# EAGLE design main (EAGLE 8.3.2)
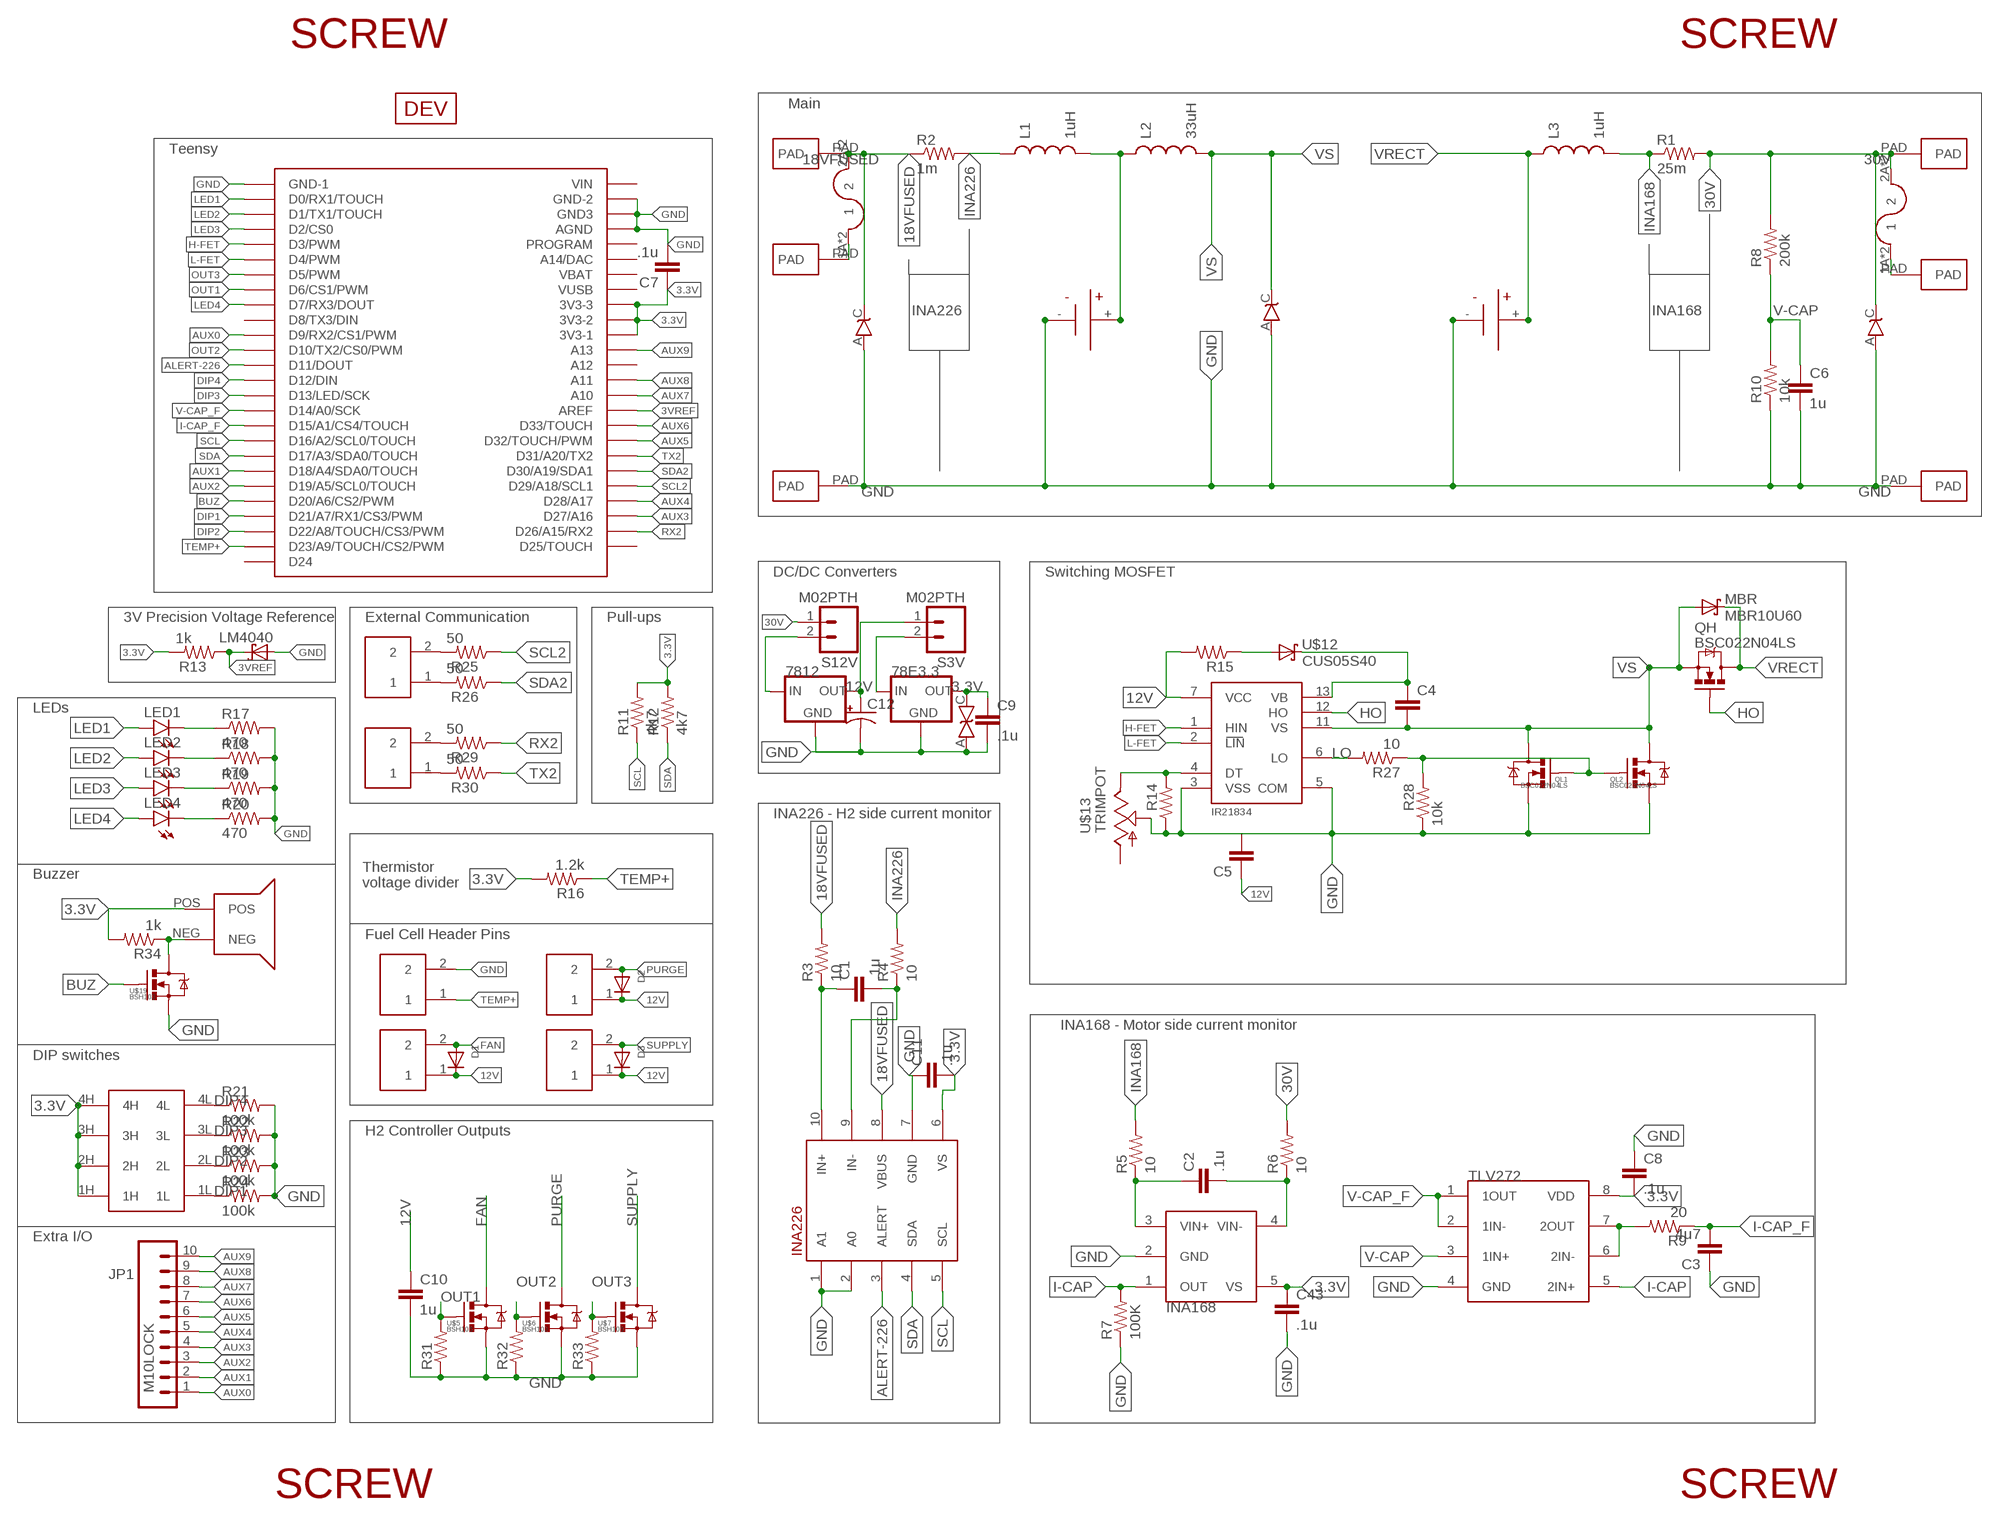
[diagram p0: schematic, sheet 1]

## Parts
78E3.3  V_REG_78XXR-78E  [V78W]
7812  V_REG_78XX  [V78W_BACKWARDS]
C1  .1u  CAP0603-CAP  [0603-CAP]
C1-1  2400u  CAP-AL_ELECTROLYTIC  [CAP-RADIAL]
C2  .1u  CAP0603-CAP  [0603-CAP]
C2-1  2400u  CAP-AL_ELECTROLYTIC  [CAP-RADIAL]
C3  4u7  CAP0603-CAP  [0603-CAP]
C4  CAP0603-CAP  [0603-CAP]
C5  CAP0603-CAP  [0603-CAP]
C6  1u  CAP0603-CAP  [0603-CAP]
C7  .1u  CAP0603-CAP  [0603-CAP]
C8  .1u  CAP0603-CAP  [0603-CAP]
C9  .1u  CAP0603-CAP  [0603-CAP]
C10  1u  CAP0603-CAP  [0603-CAP]
C11  .1u  CAP0603-CAP  [0603-CAP]
C12  10UF-25V-20%(PTH)  [CPOL-RADIAL-10UF-25V]
C43  .1u  CAP0603-CAP  [0603-CAP]
D1  DIODESOT23_REFLOW  [SOT23-R]
D2  DIODESOT23_REFLOW  [SOT23-R]
D3  DIODESOT23_REFLOW  [SOT23-R]
FAN  HEADER2  [2PINVALULOK]
I2C  HEADER2  [2PINVALULOK]
INFUSE  FUSE  [AUTO_FUSE]
JP1  M10LOCK  [1X10_LOCK]
L1  1uH  INDUCTORSER2010-102  [SER20XX]
L2  33uH  D1787-AL  [D1787]
L3  1uH  INDUCTORSER2010-102  [SER20XX]
LED1  LED0603  [LED-0603]
LED2  LED0603  [LED-0603]
LED3  LED0603  [LED-0603]
LED4  LED0603  [LED-0603]
MBR  MBR10U60  [TO-277]
OUTFUSE  FUSE  [AUTO_FUSE]
PURGEVALVE  HEADER2  [2PINVALULOK]
QH  BSC022N04LS  [PG-TDSON-8]
QL1  BSC022N04LS  [PG-TDSON-8]
QL2  BSC022N04LS  [PG-TDSON-8]
R1  25m  RESISTOR2512  [R2512]
R2  1m  RESISTOR2512  [R2512]
R3  10  RESISTOR0603-RES  [0603-RES]
R4  10  RESISTOR0603-RES  [0603-RES]
R5  10  RESISTOR0603-RES  [0603-RES]
R6  10  RESISTOR0603-RES  [0603-RES]
R7  100K  RESISTOR0603-RES  [0603-RES]
R8  200k  RESISTOR0603-RES  [0603-RES]
R9  20  RESISTOR0603-RES  [0603-RES]
R10  10k  RESISTOR0603-RES  [0603-RES]
R11  4k7  RESISTOR0603-RES  [0603-RES]
R12  4k7  RESISTOR0603-RES  [0603-RES]
R13  1k  RESISTOR0603-RES  [0603-RES]
R14  RESISTOR0603-RES  [0603-RES]
R15  RESISTOR0603-RES  [0603-RES]
R16  1.2k  RESISTOR0603-RES  [0603-RES]
R17  470  RESISTOR0603-RES  [0603-RES]
R18  470  RESISTOR0603-RES  [0603-RES]
R19  470  RESISTOR0603-RES  [0603-RES]
R20  470  RESISTOR0603-RES  [0603-RES]
R21  100k  RESISTOR0603-RES  [0603-RES]
R22  100k  RESISTOR0603-RES  [0603-RES]
R23  100k  RESISTOR0603-RES  [0603-RES]
R24  100k  RESISTOR0603-RES  [0603-RES]
R25  50  RESISTOR0603-RES  [0603-RES]
R26  50  RESISTOR0603-RES  [0603-RES]
R27  10  RESISTOR0402-RES  [0402-RES]
R28  10k  RESISTOR0603-RES  [0603-RES]
R29  50  RESISTOR0603-RES  [0603-RES]
R30  50  RESISTOR0603-RES  [0603-RES]
R31  RESISTOR0603-RES  [0603-RES]
R32  RESISTOR0603-RES  [0603-RES]
R33  RESISTOR0603-RES  [0603-RES]
R34  1k  RESISTOR0603-RES  [0603-RES]
S3V  M02PTH  [1X02]
S12V  M02PTH  [1X02]
SERIAL2  HEADER2  [2PINVALULOK]
SUPPLYVALVE  HEADER2  [2PINVALULOK]
THERMISTOR  HEADER2  [2PINVALULOK]
TVS1  TVS_UNIDO-214AB  [DO-214AB]
TVS2  TVS_UNIDO-214AB  [DO-214AB]
TVS3  TVS_UNIDO-214AB  [DO-214AB]
TVS4  3.3V  TVS_BISOD-523  [SOD-523]
U1  INA226  [PSOP-10]
U2  INA168INA168  [SOT23-5]
U3  TLV272  [8-VSSOP]
U$1  PAD  [PAD]
U$2  PAD  [PAD]
U$3  PAD  [PAD]
U$5  BSH103  [SOT23-3]
U$6  BSH103  [SOT23-3]
U$7  BSH103  [SOT23-3]
U$8  SCREW  [M3HOLE]
U$9  IR21834  [SO14]
U$10  PAD  [PAD]
U$11  SCREW  [M3HOLE]
U$12  CUS05S40  [SOD323_ST]
U$13  TRIMPOT  [3MM_TRIMM]
U$14  LM4040  [SOT23-3]
U$16  PAD  [PAD]
U$17  SCREW  [M3HOLE]
U$18  BUZZER12MM  [BUZZER_12MM]
U$19  BSH103  [SOT23-3]
U$20  DIP_SWITCH  [DIPSWITCH4]
U$21  DEV  [DEV]
U$24  PAD  [PAD]
U$26  TEENSY30-FULL  [TEENSY30-FULL]
U$29  SCREW  [M3HOLE]

## Nets
3.3V: 78E3.3.OUT C7.1 C8.2 C9.1 C11.2 C43.1 R11.2 R12.2 R13.2 R16.2 R34.2 TVS4.C U1.6(VS) U2.5(VS) U3.8(VDD) U$18.POS U$20.1H U$20.2H U$20.3H U$20.4H U$26.3V3(3V3-1) U$26.3V3-1(3V3-2) U$26.3V3-2(3V3-3)
3VREF: R13.1 U$14.1(C) U$26.AREF
12V: 7812.OUT C5.1 C10.1 C12.1(+) D1.3(C) D2.3(C) D3.3(C) FAN.1 PURGEVALVE.1 R15.2 S3V.1 SUPPLYVALVE.1 U$9.7(VCC)
18V: INFUSE.1A INFUSE.1B U$24.PAD
18VFUSED: INFUSE.2A INFUSE.2B R2.1 R3.2 TVS1.C U1.8(VBUS) U$3.PAD
30V: OUTFUSE.2A OUTFUSE.2B R1.2 R6.2 R8.2 S12V.1 TVS3.C U$1.PAD
30VFUSED: OUTFUSE.1A OUTFUSE.1B U$16.PAD
ALERT-226: U1.3(ALERT) U$26.D11/DOUT
AUX0: JP1.1 U$26.D9/RX2/CS1/PWM
AUX1: JP1.2 U$26.D18/A4/SDA/TOUCH(D18/A4/SDA0/TOUCH)
AUX2: JP1.3 U$26.D19/A5/SCL/TOUCH(D19/A5/SCL0/TOUCH)
AUX3: JP1.4 U$26.D27(D27/A16)
AUX4: JP1.5 U$26.D28(D28/A17)
AUX5: JP1.6 U$26.D32/TOUCH(D32/TOUCH/PWM)
AUX6: JP1.7 U$26.D33/TOUCH
AUX7: JP1.8 U$26.A10
AUX8: JP1.9 U$26.A11
AUX9: JP1.10 U$26.A13
BUZ: U$19.1(G) U$26.D20/A6/CS2/PWM
DIP1: R24.1 U$20.1L U$26.D21/A7/RX1/CS3/PWM
DIP2: R23.1 U$20.2L U$26.D22/A8/TOUCH/CS3/PWM
DIP3: R22.1 U$20.3L U$26.D13/LED/SCK
DIP4: R21.1 U$20.4L U$26.D12/DIN
DT: R14.2 U$9.4(DT) U$13.3(E)
FAN: D1.1(A) FAN.2 U$5.3(D)
GND: 78E3.3.GND 7812.GND C1-1.-(V-) C2-1.-(V-) C3.1 C5.2 C6.2 C7.2 C8.1 C9.2 C10.2 C11.1 C12.2(-) C43.2 QL1.1(S) QL1.2(S) QL1.3(S) QL2.1(S) QL2.2(S) QL2.3(S) R7.1 R10.1 R14.1 R17.2 R18.2 R19.2 R20.2 R21.2 R22.2 R23.2 R24.2 R28.1 R31.1 R32.1 R33.1 THERMISTOR.2 TVS1.A TVS2.A TVS3.A TVS4.A U1.1(A1) U1.2(A0) U1.7(GND) U2.2(GND) U3.4(GND) U$2.PAD U$5.2(S) U$6.2(S) U$7.2(S) U$9.3(VSS) U$9.5(COM) U$10.PAD U$13.2(S) U$14.2(A) U$19.2(S) U$26.AGND U$26.GND-1 U$26.GND-2 U$26.GND-3(GND3)
H-FET: U$9.1(HIN) U$26.D3/PWM
HO: QH.4(G) U$9.12(HO)
I-CAP: R7.2 U2.1(OUT) U3.5(2IN+)
I-CAP_F: C3.2 R9.1 U$26.D15/A1/CS4/TOUCH
INA168: L3.1 R1.1 R5.2
INA226: L1.2 R2.2 R4.2
L-FET: U$9.2(LIN) U$26.D4/PWM
LED1: LED1.A U$26.D0/RX1/TOUCH
LED2: LED2.A U$26.D1/TX1/TOUCH
LED3: LED3.A U$26.D2/CS0
LED4: LED4.A U$26.D7/RX3/DOUT
LO: QL1.4(G) QL2.4(G) R27.1 R28.2
N$1: C1.1 R3.1 U1.10(IN+)
N$2: C2.1 R5.1 U2.3(VIN+)
N$3: C1.2 R4.1 U1.9(IN-)
N$4: C2.2 R6.1 U2.4(VIN-)
N$5: R15.1 U$12.A
N$6: C1-1.+(V+) L1.1 L2.P$2
N$7: LED1.C R17.1
N$8: LED2.C R18.1
N$9: R9.2 U3.6(2IN-) U3.7(2OUT)
N$10: LED3.C R19.1
N$13: LED4.C R20.1
N$14: I2C.2 R25.2
N$15: I2C.1 R26.2
N$16: R34.1 U$18.NEG U$19.3(D)
N$17: R27.2 U$9.6(LO)
N$18: 78E3.3.IN S3V.2
N$19: 7812.IN S12V.2
N$28: R29.2 SERIAL2.2
N$29: R30.2 SERIAL2.1
OUT1: R31.2 U$5.1(G) U$26.D6/CS1/PWM
OUT2: R32.2 U$6.1(G) U$26.D10/TX2/CS0/PWM
OUT3: R33.2 U$7.1(G) U$26.D5/TX1/PWM(D5/PWM)
PURGE: D2.1(A) PURGEVALVE.2 U$6.3(D)
RX2: R29.1 U$26.D26/RX2(D26/A15/RX2)
SCL: R11.1 U1.5(SCL) U$26.D16/A2/SCL/TOUCH(D16/A2/SCL0/TOUCH)
SCL2: R25.1 U$26.D29(D29/A18/SCL1)
SDA: R12.1 U1.4(SDA) U$26.D17/A3/SDA/TOUCH(D17/A3/SDA0/TOUCH)
SDA2: R26.1 U$26.D30(D30/A19/SDA1)
SUPPLY: D3.1(A) SUPPLYVALVE.2 U$7.3(D)
TEMP+: R16.1 THERMISTOR.1 U$26.D23/A9/TOUCH/CS2/PWM
TX2: R30.1 U$26.D31/TX2(D31/A20/TX2)
V-CAP: C6.1 R8.1 R10.2 U3.3(1IN+)
V-CAP_F: U3.1(1OUT) U3.2(1IN-) U$26.D14/A0/SCK
VB: C4.1 U$9.13(VB) U$12.C
VRECT: C2-1.+(V+) L3.2 MBR.3(C) QH.5(D) QH.6(D) QH.7(D) QH.8(D) QH.TH(D)
VS: C4.2 L2.P$1 MBR.1(A) MBR.2(A) QH.1(S) QH.2(S) QH.3(S) QL1.5(D) QL1.6(D) QL1.7(D) QL1.8(D) QL1.TH(D) QL2.5(D) QL2.6(D) QL2.7(D) QL2.8(D) QL2.TH(D) TVS2.C U$9.11(VS)
Unconnected: U$13.1(A) U$26.A12 U$26.A14/DAC U$26.D8/TX3/DIN U$26.D24 U$26.D25/TOUCH U$26.PROGRAM U$26.VBAT U$26.VIN U$26.VUSB

## Notes on the sheet
- Main
- Teensy
- INA226 | INA168
- DC/DC Converters | Switching MOSFET
- 3V Precision Voltage Reference | External Communication | Pull-ups
- LEDs
- INA226 - H2 side current monitor
- Buzzer
- Thermistor
  voltage divider
- Fuel Cell Header Pins
- INA168 - Motor side current monitor
- DIP switches
- H2 Controller Outputs
- Extra I/O

## Library data of the parts
78E3.3 7812 = 2018:V_REG_78XX: Voltage Regulator Standard 7805 5V regulator. IGO (Input Ground Output). Spark Fun Electronics SKU : COM-00107
C1-C11 C43 = SparkFun-Passives:CAP: Capacitor Standard 0603 ceramic capacitor, and 0.1" leaded capacitor.
C1-1 C2-1 = 2018:CAP-AL_ELECTROLYTIC
C12 = SparkFun-Capacitors:10UF-25V-20%(PTH): CAP-08440; PROD_ID: CAP-08440
D1-D3 = adafruit:DIODE: Diode SMADIODE - SMA Surface Mount Package 20V 1A Schottky Diode Digikey: 641-1014-6-ND DO-1N4148 - Through Hole Small Current Diode SOD-123 20V 1 A (.5mV Vf) Schottky Diode - Digikey: MBRX120TPMSCT-ND SOD-323 10V 570mA (.38mV Vf, 3ns) Schottky Diode - Digikey: ZLLS410CT-ND SOD-523 30V 30mA Schottky Diode (RB751S-40TE61) - Digikey: RB751S-40TE61CT-ND SOT23-R/W - SOT23 Package (R = Solder Paste/Reflow Ovens, W = Hand-Soldering) BAT54Film 40V 300mA - Digikey: 497-7162-1-ND
FAN I2C PURGEVALVE SERIAL2 SUPPLYVALVE THERMISTOR = Custom_old:HEADER2
INFUSE OUTFUSE = Custom_old:FUSE
JP1 = SparkFun-Connectors:M10: Header 10 Standard 10-pin 0.1" header. Use with straight break away headers (SKU : PRT-00116), right angle break away headers (PRT-00553), swiss pins (PRT-00743), machine pins (PRT-00117), and female headers (PRT-00115).
L1 L3 = 2018:INDUCTOR
L2 = 2018:D1787-AL
LED1-LED4 = SparkFun-LED:LED: LEDs Standard schematic elements and footprints for 5mm, 3mm, 1206, and 0603 sized LEDs. 5mm - Spark Fun Electronics SKU : COM-00529 (and others)
MBR = 2018:MBR10U60
QH QL1 QL2 = 2018:BSC022N04LS
R1-R34 = SparkFun-Passives:RESISTOR: Resistor Basic schematic elements and footprints for 0603, 1206, and PTH resistors.
S3V S12V = SparkFun-Connectors:M02: Standard 2-pin 0.1" header. Use with - straight break away headers ( PRT-00116) - right angle break away headers (PRT-00553) - swiss pins (PRT-00743) - machine pins (PRT-00117) - female headers (PRT-00115) Molex polarized connector foot print use with: PRT-08233 with associated crimp pins and housings. 2.54_SCREWTERM for use with PRT-10571. 3.5mm Screw Terminal footprints for PRT-08084 5mm Screw Terminal footprints for use with PRT-08432
TVS1-TVS3 = 2018:TVS_UNI
TVS4 = 2018:TVS_BI
U1 = 2018:INA226
U2 = 2018:INA168
U3 = 2018:TLV272
U$1-U$3 U$10 U$16 U$24 = Custom_old:PAD
U$5-U$7 U$19 = 2018:BSH103
U$8 U$11 U$17 U$29 = Custom_old:SCREW
U$9 = 2018:IR21834
U$12 = 2018:CUS05S40
U$13 = 2018:TRIMPOT
U$14 = 2018:LM4040
U$18 = 2018:BUZZER
U$20 = Custom_old:DIP_SWITCH
U$21 = Custom_old:DEV
U$26 = teensy_smdpads:TEENSY30-FULL

## Board
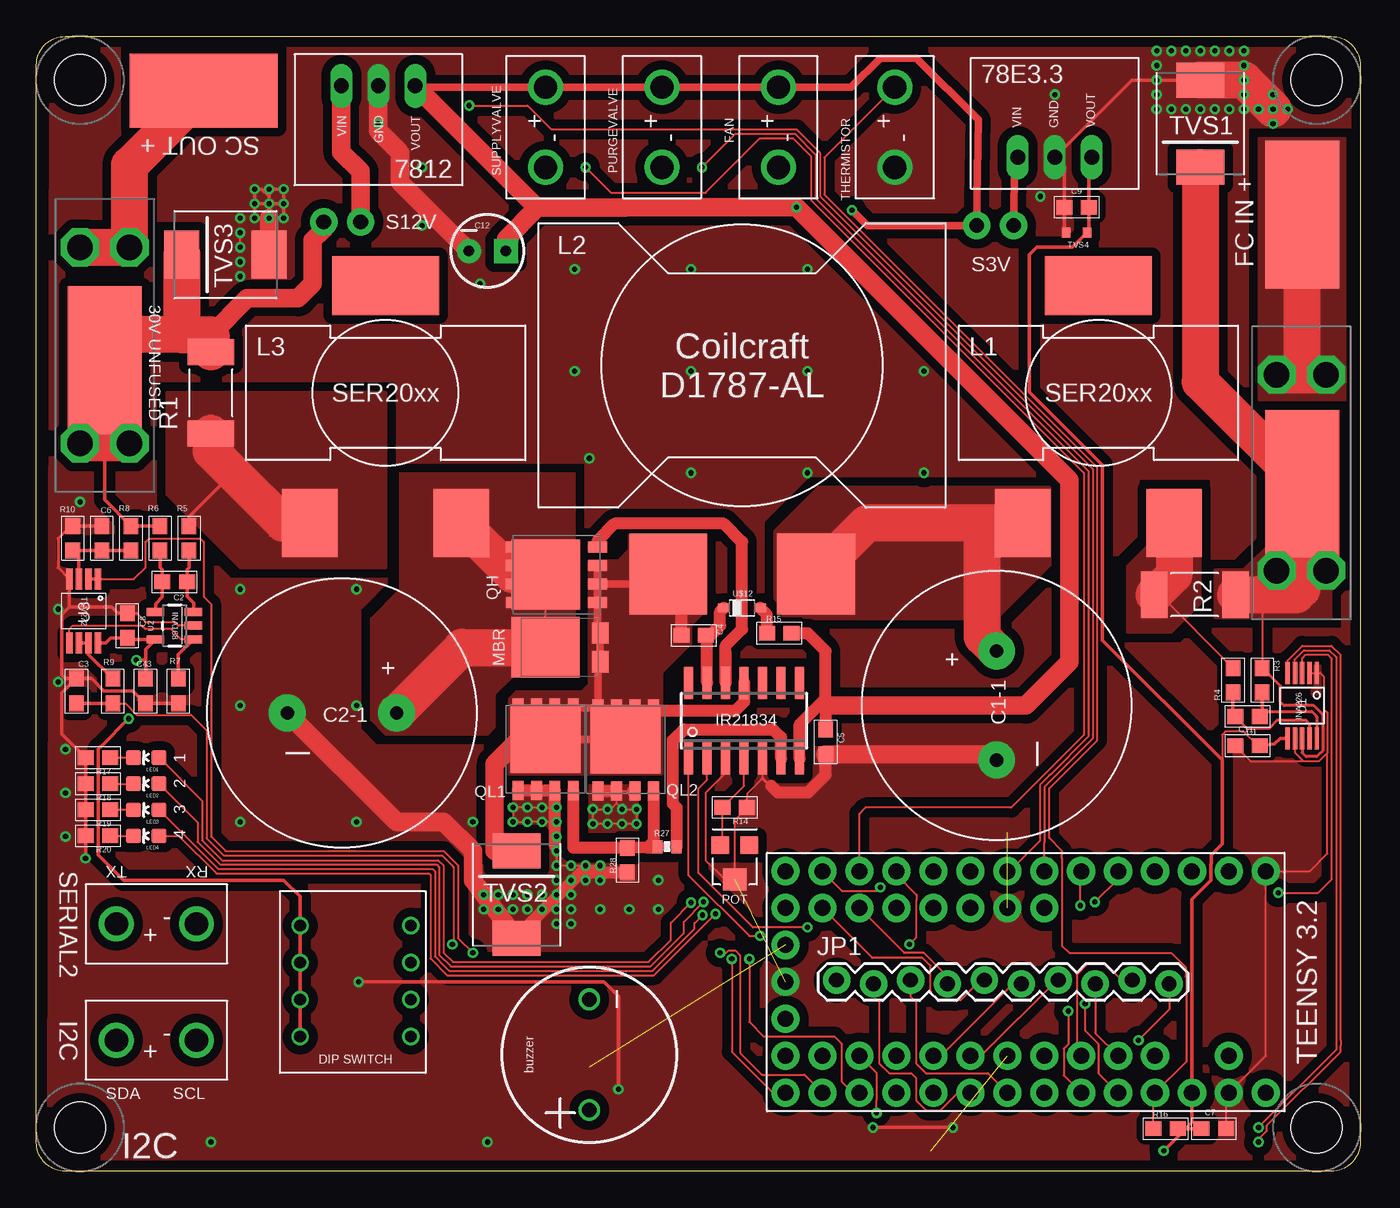
[diagram p1: board, top side]
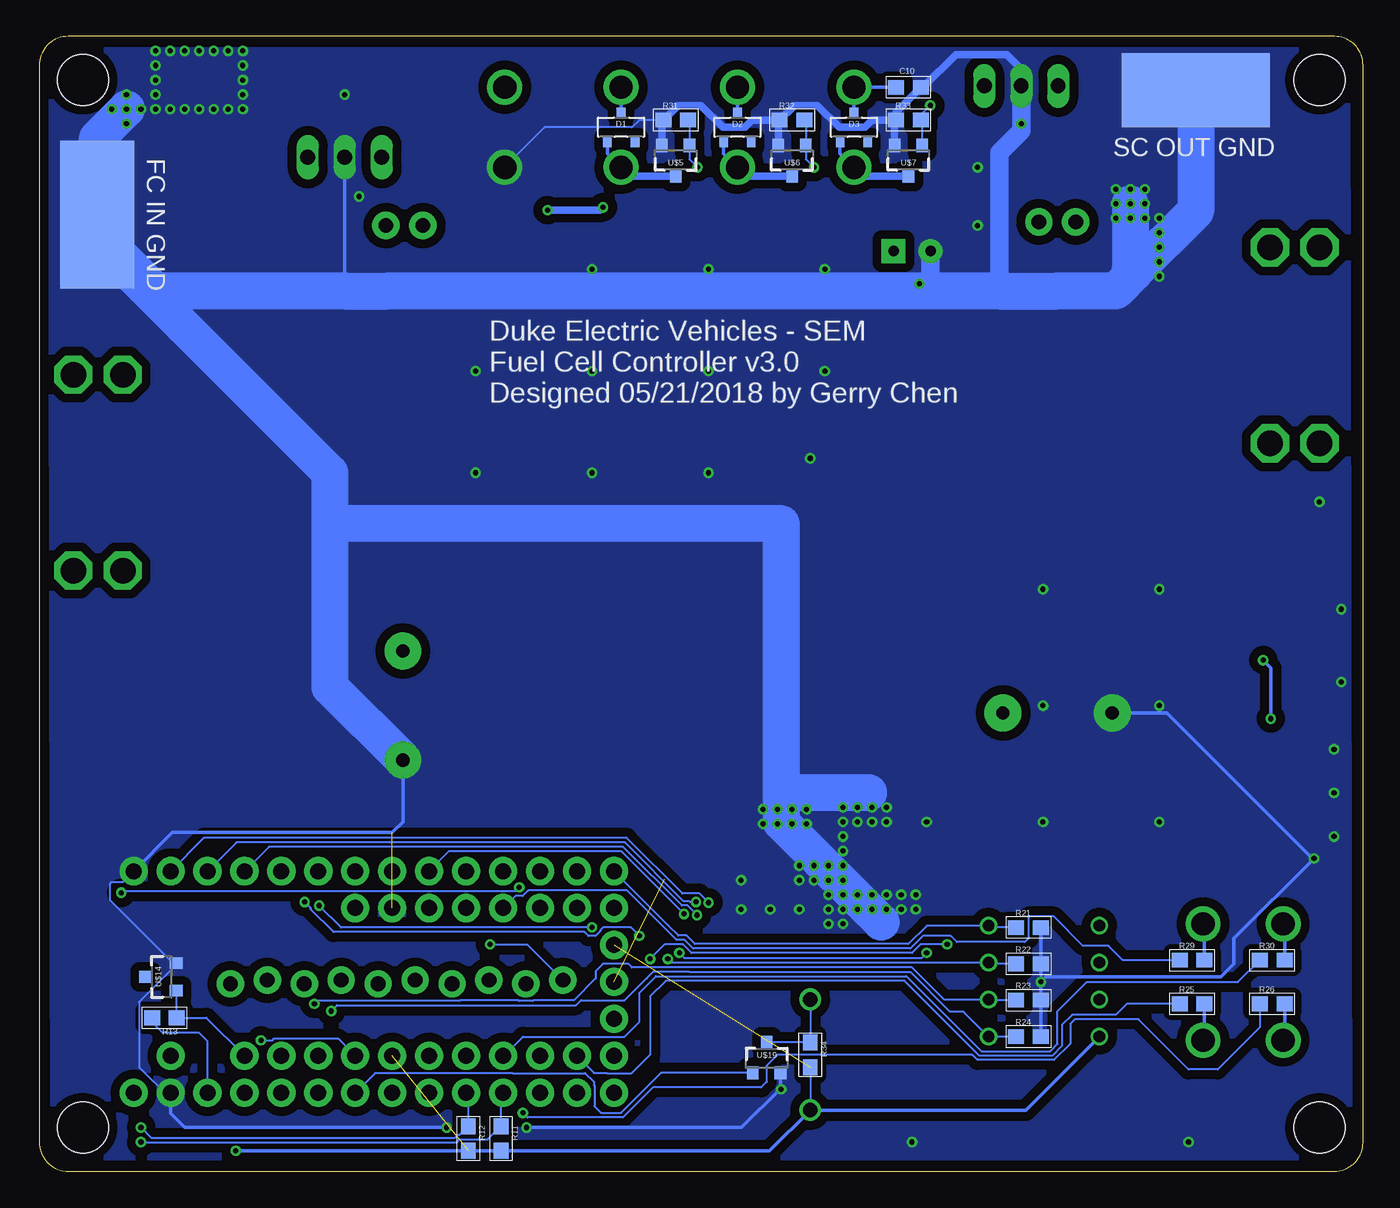
[diagram p2: board, bottom side, seen from below]

Size 91 x 78 mm. Coordinates in mm from the lower left corner, seen from the top.
Outline: 89,0 2,0 arc-90 0,2 0,76 arc-90 2,78 89,78 arc-90 91,76 91,2 arc-90 89,0
Copper layers (1*16): Top 0.0356mm / dielectric 1.5011mm / Bottom 0.0356mm
Design rules "oshpark-2layer *": minimum track width 6mil, minimum drill 13mil, track to track 6mil, track to pad 6mil, pad to pad 6mil, via to via 6mil, smd to smd 6mil, copper to edge 15mil, drill to drill 6mil, minimum pad ring 7mil, minimum via ring 7mil, stop-mask expansion 2.5mil, vias tented up to drill 0.5mm, thermal gap 10mil

### Footprints (pad centres in the part's own frame; a part is rotated, then mirrored left to right if it is on the bottom)
V78W = drill 1.016 long: GND 0,-3.81; IN -2.54,-3.81; OUT 2.54,-3.81
V78W_BACKWARDS = drill 1.016 long: GND 0,-3.81; IN 2.54,-3.81; OUT -2.54,-3.81
0603-CAP = smd 1.1 x 1: 1 -0.85,0; 2 0.85,0
CAP-RADIAL = drill 0.9 pad 2.54: + 0,-3.75; - 0,3.75
CPOL-RADIAL-10UF-25V = drill 0.7 pad 1.651 square: 1 1.27,0 | drill 0.7 pad 1.651: 2 -1.27,0
SOT23-R = smd 0.6 x 0.7: 1 -0.95,-1; 2 0.95,-1; 3 0,1
2PINVALULOK = drill 1.6: 1 0,5.5; 2 0,0
AUTO_FUSE = drill 1.75 octagon: 1A 0,3.4; 1B 0,0; 2A 13.47,3.4; 2B 13.47,0
1X10_LOCK = drill 1.016 pad 1.88: 1 0,0.127; 2 2.54,-0.127; 3 5.08,0.127; 4 7.62,-0.127; 5 10.16,0.127; 6 12.7,-0.127; 7 15.24,0.127; 8 17.78,-0.127; 9 20.32,0.127; 10 22.86,-0.127
SER20XX = smd 3.81 x 4.699: 1 -5.207,-8.954; 2 5.207,-8.954 | smd 7.366 x 4.064: 3 0,7.366
D1787 = smd 5.334 x 5.588: P$1 -5.08,-14.351; P$2 5.08,-14.351
LED-0603 = smd 1 x 1: A 0,-0.877; C 0,0.877
TO-277 = smd 1.45 x 1.15: 1 -0.985,-2.75; 2 0.985,-2.75 | smd 4.15 x 4.65: 3 0,1
PG-TDSON-8 = smd 1.3 x 0.75: 1 -2.825,1.905; 2 -2.825,0.635; 3 -2.825,-0.635; 4 -2.825,-1.905; 5 2.825,-1.905; 6 2.825,-0.635; 7 2.825,0.635; 8 2.825,1.905 | smd 4.7 x 4.8: TH 0.725,0
R2512 = smd 1.8 x 3.2: 1 -2.8,0; 2 2.8,0
0603-RES = smd 1.1 x 1: 1 -0.85,0; 2 0.85,0
0402-RES = smd 0.7 x 0.9: 1 -0.65,0; 2 0.65,0
1X02 = drill 1.016 pad 1.88: 1 0,0; 2 2.54,0
DO-214AB = smd 2.4 x 3.3: A 3,0; C -3,0
SOD-523 = smd 0.6 x 0.7: A -0.72,0; C 0.71,0
PSOP-10 = smd 1.5 x 0.3: 1 0,1; 2 0,0.5; 3 0,0; 4 0,-0.5; 5 0,-1; 6 4.5,-1; 7 4.5,-0.5; 8 4.5,0; 9 4.5,0.5; 10 4.5,1
SOT23-5 = smd 0.55 x 1.2: 1 -0.95,-1.3; 2 0,-1.3; 3 0.95,-1.3; 4 0.95,1.3; 5 -0.95,1.3
8-VSSOP = smd 0.45 x 1.45: 1 -0.975,-2.2; 2 -0.325,-2.2; 3 0.325,-2.2; 4 0.975,-2.2; 5 0.975,2.2; 6 0.325,2.2; 7 -0.325,2.2; 8 -0.975,2.2
PAD = smd 10.16 x 5.08: PAD 0,0
SOT23-3 = smd 0.8 x 0.9: 1 -0.95,-1; 2 0.95,-1; 3 0,1.1
M3HOLE = hole 3.5: 0,0
SO14 = smd 0.6 x 2.2: 1 -3.81,-2.6; 2 -2.54,-2.6; 3 -1.27,-2.6; 4 0,-2.6; 5 1.27,-2.6; 6 2.54,-2.6; 7 3.81,-2.6; 8 3.81,2.6; 9 2.54,2.6; 10 1.27,2.6; 11 0,2.6; 12 -1.27,2.6; 13 -2.54,2.6; 14 -3.81,2.6
SOD323_ST = smd 0.8 x 0.6: A 1.25,0; C -1.25,0
3MM_TRIMM = smd 1.2 x 1.2: 1 0.9,-1; 3 0.9,1 | smd 1.5 x 1.6: 2 -1.45,0
BUZZER_12MM = drill 1: NEG 0,-3.8; POS 0,3.8
DIPSWITCH4 = drill 0.8: 1H 0,7.62; 1L 0,0; 2H 2.54,7.62; 2L 2.54,0; 3H 5.08,7.62; 3L 5.08,0; 4H 7.62,7.62; 4L 7.62,0
TEENSY30-FULL = drill 1.1 pad 1.93: 3V3 7.62,11.43; 3V3-1 -2.54,-16.51; 3V3-2 5.08,-1.27; A10 5.08,6.35; A11 5.08,3.81; A12 -5.08,1.27; A13 5.08,1.27; A14/DAC 5.08,-16.51; AGND 7.62,13.97; AREF 5.08,8.89; D0/RX1/TOUCH -7.62,13.97; D1/TX1/TOUCH -7.62,11.43; D2/CS0 -7.62,8.89; D3/PWM -7.62,6.35; D4/PWM -7.62,3.81; D5/TX1/PWM -7.62,1.27; D6/CS1/PWM -7.62,-1.27; D7/RX3/DOUT -7.62,-3.81; D8/TX3/DIN -7.62,-6.35; D9/RX2/CS1/PWM -7.62,-8.89; D10/TX2/CS0/PWM -7.62,-11.43; D11/DOUT -7.62,-13.97; D12/DIN -7.62,-16.51; D13/LED/SCK 7.62,-16.51; D14/A0/SCK 7.62,-13.97; D15/A1/CS4/TOUCH 7.62,-11.43; D16/A2/SCL/TOUCH 7.62,-8.89; D17/A3/SDA/TOUCH 7.62,-6.35; D18/A4/SDA/TOUCH 7.62,-3.81; D19/A5/SCL/TOUCH 7.62,-1.27; D20/A6/CS2/PWM 7.62,1.27; D21/A7/RX1/CS3/PWM 7.62,3.81; D22/A8/TOUCH/CS3/PWM 7.62,6.35; D23/A9/TOUCH/CS2/PWM 7.62,8.89; D24 -5.08,-3.81; D25/TOUCH -5.08,-6.35; D26/RX2 -5.08,-8.89; D27 -5.08,-11.43; D28 -5.08,-13.97; D29 5.08,-13.97; D30 5.08,-11.43; D31/TX2 5.08,-8.89; D32/TOUCH 5.08,-6.35; D33/TOUCH 5.08,-3.81; GND-1 -7.62,16.51; GND-2 0,-16.51; GND-3 -5.08,-1.27; PROGRAM 2.54,-16.51; VBAT -5.08,-16.51; VIN 7.62,16.51; VUSB 5.08,13.97

### Placement (x,y rotation side)
78E3.3  70,73.5 0 top
7812  23.5,70.79 180 top
C1  83.25,31.25 180 top
C1-1  66,32 180 top
C2  9.5,40.5 180 top
C2-1  21,31.5 90 top
C3  2.75,33 270 top
C4  45.19,36.83 180 top
C5  54.25,29.5 270 top
C6  4.5,43.5 90 top
C7  80.93,2.92 0 top
C8  6.25,37.5 270 top
C9  71.5,66.25 180 top
C10  31.25,74.5 0 bottom
C11  83.25,29.25 0 top
C12  31,63.25 0 top
C43  7.5,33 270 top
D1  51,71.75 0 bottom
D2  43,71.75 0 bottom
D3  35,71.75 0 bottom
FAN  51,69 0 top
I2C  11,9 90 top
INFUSE  85.25,54.75 270 top
JP1  55,13 0 top
L1  73,53.5 0 top
L2  48.5,55.39 0 top
L3  24,53.5 0 top
LED1  7.55,28.42 90 top
LED2  7.55,26.63 90 top
LED3  7.55,24.82 90 top
LED4  7.55,23.05 90 top
MBR  36,36 90 top
OUTFUSE  3,63.5 270 top
PURGEVALVE  43,69 0 top
QH  35.75,41 180 top
QL1  35,29 90 top
QL2  40.5,28.96 90 top
R1  12,53.5 90 top
R2  79.62,39.62 180 top
R3  84.25,33.75 90 top
R4  82.25,33.75 90 top
R5  10.5,43.5 90 top
R6  8.5,43.5 90 top
R7  9.75,33 90 top
R8  6.5,43.5 90 top
R9  5.25,33 90 top
R10  2.5,43.5 270 top
R11  59.25,2.25 270 bottom
R12  61.5,2.25 270 bottom
R13  82.39,10.54 180 bottom
R14  48,25 180 top
R15  51.06,36.97 0 top
R16  77.62,2.92 0 top
R17  4.24,28.42 180 top
R18  4.24,26.63 180 top
R19  4.24,24.84 180 top
R20  4.24,23.05 180 top
R21  23,16.75 0 bottom
R22  23,14.25 0 bottom
R23  23,11.75 0 bottom
R24  23,9.25 0 bottom
R25  11.75,11.5 0 bottom
R26  6.25,11.5 0 bottom
R27  43.35,22.3 0 top
R28  40.62,21.38 90 top
R29  11.75,14.5 0 bottom
R30  6.25,14.5 0 bottom
R31  47.25,72.25 0 bottom
R32  39.25,72.25 0 bottom
R33  31.25,72.25 0 bottom
R34  38,8 270 bottom
S3V  64.62,65 0 top
S12V  19.75,65.25 0 top
SERIAL2  11,17 90 top
SUPPLYVALVE  35,69 0 top
THERMISTOR  59,69 0 top
TVS1  80,72 90 top
TVS2  33,19 270 top
TVS3  13,63 0 top
TVS4  71.5,64.5 0 top
U1  87,34.25 270 top
U2  9.5,37.5 90 top
U3  3.25,38.5 180 top
U$1  4.69,55.75 270 top
U$2  11.5,74.31 180 bottom
U$3  87,47.25 90 top
U$5  47.25,69.5 180 bottom
U$6  39.25,69.5 180 bottom
U$7  31.25,69.5 180 bottom
U$8  88,3 0 top
U$9  48.64,30.96 0 top
U$10  87,65.75 90 bottom
U$11  88,75 0 top
U$12  48.5,38.72 0 top
U$13  48,21.5 90 top
U$14  82.58,13.36 90 bottom
U$16  11.5,74.25 0 top
U$17  3,75 0 top
U$18  38,8 180 top
U$19  41,7.75 0 bottom
U$20  25.75,9.25 90 top
U$21  16.12,1.3 0 top
U$24  87,65.75 90 top
U$26  68,13 270 top
U$29  3,3 180 top

### Tracks (layer width: path | path; a pad name or v marks a point on that pad's centre or on a via)
3.3V  (via drill 0.35)  (2 unrouted)
  Top 0.152: 4.4,36.3 U3.8 4.25,36.27 4.25,35.75 | C11.2 83.94,29.25 82.97,30.22 81.72,30.22 81.5,30 81.5,28.25 | 72.35,64.64 TVS4.C
  Top 0.25: 79,2.92 R16.2 | U3.8 4.75,36.3 5.1,36.65 C8.2 5.85,36.55 U2.5 7.5,35.85 7.5,35 C43.1 | U1.6 85.5,29.75 85.1,29.35 C11.2
  Top 0.254: 79,2.92 C7.1 | U$20.1H U$20.2H U$20.3H U$20.4H 18.13,18.87 17,20 6,20 4.25,21.75 4.25,29.02 4.42,29.2 4.45,29.2 v6.35,31.1 | 79,2.92 79.43,3.35 U$26.3V3 79.43,18.68 80.72,19.98 80.72,21.14 80.75,21.16 80.75,21.75 81.5,22.5 81.5,28.25 73.27,36.48 73.27,48.53 68.25,53.55 68.25,63 68.75,63.5 71.21,63.5 TVS4.C | v77.48,1.4 79,2.92 | 78E3.3.OUT 72.35,69.5 C9.1 72.35,64.64 | v6.88,35.12 7.38,35.12 7.5,35
  Bottom 0.152: R13.2 83.24,10.24 82.5,9.5 80,9.5 79.43,8.93 U$26.3V3 | R34.2 U$18.POS
  Bottom 0.254: v77.48,1.4 R12.2 R11.2 40.8,1.4 U$18.POS 23.18,4.2 U$20.1H | v6.35,31.1 6.35,34.6 v6.88,35.12
3VREF
  Bottom 0.152: U$26.AREF 79.51,10.54 R13.1 81.58,10.58 U$14.1
12V  (via drill 0.35)
  Top 0.508: 50.75,66.25 v52.25,66.25 | 26.14,74.5 SUPPLYVALVE.1 PURGEVALVE.1 FAN.1 56,74.5 58,76.5 60.5,76.5 64.73,72.27 S3V.1 57.12,65 v56.06,66.06
  Top 0.813: 54.25,32.5 54.25,32 C5.1 | U$9.7 52.45,30.7 54.25,32.5 | R15.2 53.03,36.97 54.25,35.75 54.25,32.5
  Top 1.27: 50,66.25 50.75,66.25 | 54.25,32 68,32 71,35 71,47.5 v52.25,66.25 40.5,66.25 40.47,66.22 34.42,66.22 | 7812.OUT 26.14,74.5 34.42,66.22 | C12.1 32.27,64.07 34.42,66.22
  Bottom 0.254: D1.3 FAN.1 | PURGEVALVE.1 D2.3 | D3.3 SUPPLYVALVE.1 C10.1
  Bottom 0.508: v56.06,66.06 52.44,66.06 v52.25,66.25
18V
  Top 2.54: INFUSE.1B 87,54.75 | 87,54.75 INFUSE.1A | 87,54.75 U$24.PAD
  pour Top (no thermals): 84,53 90,53 90,71 84,71
18VFUSED
  Top 0.152: R3.2 84.25,38.25 86,40 | 86,40 87,40 | INFUSE.2B 85.25,40.75 86,40
  Top 0.2: U1.8 87,28.75 87.25,28.5 88,28.5 88.25,28.75 88.4,28.89 88.4,31.38 87.78,32 85.75,32 85.5,32.25 85.5,33.35 R3.2
  Top 0.25: R3.2 84.65,34.6
  Top 2.54: 86.05,43.25 U$3.PAD | TVS1.C 80,54.25 U$3.PAD | U$3.PAD 87,40 86.62,39.62 R2.1 | INFUSE.2B INFUSE.2A 88.28,41.28
  pour Top (no thermals): 85,52 89,52 89,38 81,38 81,41.38 83,41.38 85,43.38
30V
  Top 0.25: 4.69,50.03 4.69,46.16 R8.2 R6.2 | 4.69,50.03 U$1.PAD | OUTFUSE.2B 4.69,50.03 | 4.69,50.03 OUTFUSE.2A
  Top 1.27: S12V.1 19.73,64.73 19,64 19,61 18,60 14.5,60 12,57.5
  Top 2.54: R1.2 12,57.5 10,57.5 | U$1.PAD 6.44,57.5 10,57.5 | OUTFUSE.2A OUTFUSE.2B | TVS3.C 10,57.5
30VFUSED
  Top 2.54: OUTFUSE.1B OUTFUSE.1A 6.4,69.15 U$16.PAD
ALERT-226  (via drill 0.35)
  Top 0.152: 87,34.97 U1.3 87,35.25 87.25,35.5 88.75,35.5 89.04,35.21 89.04,20.07 88.11,19.14 v85.36,19.14 | U$26.D11/DOUT 55.38,19.27 57.77,19.27 v58,19.5
  Bottom 0.152: v85.36,19.14 85.23,19.27 58.23,19.27 v58,19.5
AUX0  (via drill 0.35)
  Top 0.152: U$26.D9/RX2/CS1/PWM 59.11,20.39 60.5,19 60.5,18.62 60.46,18.57 60.46,16.04 v60,15.58
  Bottom 0.152: v60,15.58 57.45,15.58 JP1.1
AUX1
  Top 0.152: JP1.2 57.54,12.03 57.92,11.65 57.92,7.43 58.62,6.73 60.14,6.73 60.46,6.41 60.46,4.89 61.16,4.19 62.14,4.19 63.34,5.38 U$26.D18/A4/SDA/TOUCH
AUX2
  Top 0.152: JP1.3 60.08,12.03 60.46,11.65 60.46,7.43 61.16,6.73 65.38,6.73 U$26.D19/A5/SCL/TOUCH
AUX3
  Top 0.152: JP1.4 62.62,13.38 61,15 59.65,15 U$26.D27
AUX4
  Top 0.152: JP1.5 64.88,13.13 63.5,11.75 63.15,11.75 63.1,11.71 62.05,11.71 61.5,12.25 61.5,12.34 61.45,12.39 61.45,14.12 60.91,14.66 57.45,14.66 U$26.D28
AUX5
  Top 0.152: JP1.6 67.12,12.87 62.25,8 61.73,8 U$26.D32/TOUCH
AUX6
  Top 0.152: JP1.7 70.13,13.13 64.92,7.92 U$26.D33/TOUCH
AUX7
  Top 0.152: JP1.8 72.78,9.49 U$26.A10
AUX8
  Top 0.152: JP1.9 74.62,13.13 73.5,14.25 72.25,14.25 71.5,13.5 71.5,8.23 U$26.A11
AUX9  (via drill 0.35)
  Top 0.152: JP1.10 77.86,11.11 v75.75,9
  Bottom 0.152: v75.75,9 74.96,9 74.84,9.11 70.46,9.11 U$26.A13
BUZ
  Bottom 0.152: U$26.D20/A6/CS2/PWM 67.92,6.73 59,6.73 58.48,6.73 53.48,6.73 52.88,6.12 52.88,5.91 52.84,5.87 52.84,4.46 52.5,4.12 52.38,4 51,4 48.25,6.75 U$19.1
DIP1  (via drill 0.35)
  Top 0.152: v70.92,11 70.92,8.72 70.62,8.41 70.62,6.57 U$26.D21/A7/RX1/CS3/PWM
  Bottom 0.152: R24.1 U$20.1L 27.46,10.96 28.39,10.96 31.13,13.7 46,13.7 46.3,13.7 48.8,13.7 49,13.5 49.25,13.25 50.75,11.75 53.75,11.75 54.1,11.4 70.52,11.4 v70.92,11
DIP2  (via drill 0.35)
  Top 0.152: v72.08,11.5 72.08,9.67 73,8.75 73,8.42 73,8.41 73,6.73 U$26.D22/A8/TOUCH/CS3/PWM
  Bottom 0.152: R23.1 25.71,11.75 U$20.2L 28.79,11.79 31,14 50.25,14 50.5,14.25 52.25,14.25 52.75,13.75 52.75,13.25 54.25,11.75 57.01,11.75 57.06,11.71 58.02,11.71 58.07,11.75 62.09,11.75 62.14,11.71 71.88,11.71 v72.08,11.5
DIP3  (via drill 0.35)
  Top 0.152: v47.8,14.58 47.8,8.21 50.62,5.38 U$26.D13/LED/SCK
  Bottom 0.152: R22.1 25.67,14.25 U$20.3L 47.54,14.33 v47.8,14.58
DIP4
  Bottom 0.152: R21.1 25.63,16.75 U$20.4L 29.99,16.87 31.25,15.61 45.92,15.61 46.51,16.19 47.06,16.19 47.74,16.87 47.94,17.07 U$26.D12/DIN
DT
  Top 0.152: U$13.3 47.15,22.55 R14.2 48.64,26.49 U$9.4
FAN
  Bottom 0.254: D1.1 51.95,69.95 FAN.2
  Bottom 0.508: U$5.3 50.4,68.4 FAN.2
GND  (via drill 0.35)  (2 unrouted)
  Top 0.152: U2.2 9.75,37.5 9.5,37.75 7.5,37.75 6.9,38.35 C8.1 | C7.2 81.78,5.19 U$26.AGND 84.51,7.92 U$26.GND-1 87.51,20.62 88.73,21.84 88.73,28.76 | U1.2 U1.1 88.25,34.25 88.5,34 88.5,31.75 88.73,31.52 88.73,28.76 | 88.73,28.76 88.14,28.17 87.11,28.17 | U1.7 86.5,28.79 87.11,28.17 | 87.11,28.17 83.48,28.17 C11.1 | U$9.5 49.91,27 48.85,25.94 R14.1 48,24.15 U$13.2 47.92,20.12 47.25,20.12 46,21.38 46,26 47.37,27.37 U$9.3 | C3.1 3.15,33.85 | 41,26.14 41,26 40.87,26.14 QL2.2 39.87,25.26 | v85,72 v85,73 | v85,73 v85,74 | v85,73 v84,73 | v85,73 v86,73 | 39.87,25.26 v40.25,24.88 v41.25,24.88 v41.25,23.88 v40.25,23.88 v39.25,23.88 v38.25,23.88 v38.25,24.88 v39.25,24.88 39.48,24.88 39.87,25.26 | 35.63,25 v34.75,25 v33.75,25 v32.75,25 v32.75,24 v33.75,24 v34.75,24 v35.75,24 | v35.75,25 35.75,24.11 35.63,24 | 35.63,22.36 35.75,22.48 v35.75,23 v35.75,22 v35.75,21 v36.75,21 v37.75,21 v38.75,21 | v14,63.5 v14,64.5
  Top 0.2: R10.1 2.35,44.35 1.5,43.5 1.5,41.48 U3.4
  Top 0.25: U3.4 2.27,38.77 | 2.27,38.77 5.17,38.77 5.6,38.35 C8.1 6.65,38.35 | C6.2 R10.1 | R7.1 C43.2 6.63,33.02 4.63,33.02 3.81,33.85 C3.1 2,33.85 1.75,34.1 1.75,38.25 2.27,38.77
  Top 0.254: 50.5,26.5 50.41,26.5 49.91,27 | U$9.5 49.91,29.34 | 47.37,29.37 U$9.3 | TVS4.A 70.65,64.63 C9.2 70.65,69.04 78E3.3.GND 75.31,75 TVS1.A | C3.1 2.73,33.85 1.75,32.88 1.75,30.06 R17.2 R18.2 R19.2 R20.2 3.39,21.52 v3.38,21.5 | v22.15,13 39,13 40,12 v40,5.62 | v63,3 v57.5,3 | 16,67 v16,67.5 v17,67.5 v17,66.5 | 16,67 v16,66.5 | v16,66.5 v17,66.5 | v17,66.5 v17,65.5 v16,65.5 | v16,65.5 v16,66.5 | v16,66.5 v15,66.5 | v15,66.5 v15,67.5 15.5,67.5 16,67 | v15,66.5 v15,65.5 v16,65.5
  Top 0.813: QL2.1 QL2.2 | 41,26.14 QL2.3 | C5.2 54.25,27.25 53,26 51,26 50.5,26.5 | QL1.1 QL1.2 QL1.3 35.63,25 35.63,24 35.63,22.36 | TVS2.A 33.9,17 37.45,20.55 R28.1
  Top 1.27: v16,65.5 TVS3.A | 7812.GND 23.5,71.5 25,70 25,67.98 C12.2 | C2-1.- 24.75,24 28,24 30,22 30,20 TVS2.A | C5.2 65.6,28.65 C1-1.-
  Top 2.54: TVS1.A v83,75 v85,73
  Bottom 0.152: 67.25,60.75 67,60.5 | R31.1 49.75,72.25 50.25,71.75 56.25,71.75 THERMISTOR.2 | U$26.GND-1 85.25,19.88 86,19.88 86.12,19.75 86.12,18.62 81.81,14.31 U$14.2 81.58,14.17 84.12,11.62 84.12,7.16 81.97,5 | v40.25,24.88 40.25,25.75 40.12,25.89 | v33.75,25 33.75,25.75 34,26
  Bottom 0.254: R21.2 R22.2 v22.15,13 | R24.2 R23.2 v22.15,13 | 32.2,72.15 R33.1 32.1,72.8 | 40.2,72.15 R32.1 | 48.2,72.15 R31.1 | 3.44,21.44 8.88,16 8.88,14.25 9.77,13.36 21.79,13.36 v22.15,13 | 3.44,21.44 v3.38,21.5 | 40.05,5.67 U$19.2 | 40.05,5.67 v40,5.62 | U$26.AGND 81.97,5 81.97,3.97 81,3 v63,3 | v57.5,3 42.73,3 40.05,5.67 | C2-1.- 13.5,31.5 3.44,21.44 | 78E3.3.GND 70,60.5 | C1-1.- 66,24 66.73,23.27 81.86,23.27 U$26.GND-1 | 40.12,25.89 40,26
  Bottom 0.508: U$7.2 32.2,72.15 | U$6.2 40.2,72.15 | U$5.2 48.2,72.15 | 32.1,72.8 C10.2 30.25,74.5 28,76.75 24.5,76.75 23.5,75.75 7812.GND | R33.1 33.75,72.25 34.25,71.75 36,71.75 37.5,73.25 39.1,73.25 R32.1 42,72.25 42.5,71.75 44,71.75 45.5,73.25 47.1,73.25 R31.1
  Bottom 1.27: 21.45,60.95 21,60.5 | C12.2 29.73,60.77 30,60.5 | 7812.GND 23.5,71.5 25,70 25,60.5
  Bottom 2.54: U$10.PAD 86.25,63.75 83,60.5 70,60.5 67,60.5 30,60.5 25,60.5 21,60.5 17,60.5 15.75,61.75 | 71,44.5 40,44.5 40,26 | C1-1.- 71,33.25 71,44.5 | 34,26 40,26 | 40,26 40,24 33.11,17.11 | 71,44.5 71,48 87,64 U$10.PAD | U$10.PAD 87,71 v85,73 | 15.75,61.75 11.5,66 U$2.PAD | v16,66.5 16,62 15.75,61.75
  other vias: 38.75,20 37.75,20 36.75,20 35.75,20 34.75,18 33.75,18 32.75,18 31.75,18 30.75,18 35.75,18 35.75,17 36.75,17 36.75,18 35.75,19 36.75,19 34.75,19 33.75,19 32.75,19 31.75,19 30.75,19 83,74 83,76 83,77 82,77 81,77 80,77 79,77 78,77 77,76 77,77 77,75 77,74 77,73 78,73 79,73 80,73 81,73 82,73 83,73 14,65.5 14,62.5 14,61.5 23.5,72 70,74 69,67 2,23 3,46 1.5,38.62 1.5,33.62 14,24 14,32 14,40 22,40 22,32 22,24 30,24 12,2 31,2 2,29 2,26 26.5,69 26.5,65 30.5,61 37,62 45,62 53,62 53,55 45,55 37,55 45,48 53,48 61,55 61,48 38,49 38.75,18 40.75,18 42.75,20 42.75,18
  pour Bottom (no thermals): 39,43.5 40,42.5 81,42.5 83,44.5 83,56 84.5,57.5 88,57.5 88,62.5 40,62.5 39,61.5
  pour Top (isolate 0.61, rank 2, no thermals): 1.12,77 90.12,77 90,1 1,1
  pour Bottom (isolate 0.61, rank 2, no thermals): 1,1 1.12,77 90.12,77 90,1
H-FET  (via drill 0.35)
  Top 0.152: v49.75,16.17 49,16.17 44.83,20.34 U$9.1 | v72.75,18.5 74.35,20.1 U$26.D3/PWM
  Bottom 0.152: v49.75,16.17 50.33,16.75 52.25,16.75 52.42,16.58 52.42,16.51 52.76,16.17 53.24,16.17 53.52,16.45 70.77,16.45 72.33,18.01 72.33,18.08 v72.75,18.5
HO
  Top 0.813: QH.4 38.58,43.33 39.75,44.5 47.25,44.5 48.5,43.25 48.5,37.25 47.37,36.12 U$9.12 47.37,35.62
I-CAP
  Top 0.152: U2.1 10.85,36.5 | 10.75,36.5 U2.1 | U2.1 9.95,36.55 9.25,37.25 7.5,37.25 7.25,37.5 2.5,37.5 2.27,37.27 U3.5
  Top 0.25: R7.2 9.75,35.5 U2.1
I-CAP_F  (via drill 0.35)
  Top 0.152: R9.1 6.13,32.15 6.91,31.37 10.63,31.37 11.7,30.3 11.7,22.87 12.87,21.7 27.87,21.7 28.66,20.91 28.66,15.66 v28.59,15.59 | v49,14.58 49,10.25 50,9.25 54.88,9.25 55.38,8.75 55.38,6.12 56.12,5.38 U$26.D15/A1/CS4/TOUCH
  Top 0.25: C3.2 R9.1
  Bottom 0.152: v28.59,15.59 30.41,15.59 31,15 46.18,15 46.76,15.58 48,15.58 v49,14.58
INA168
  Top 0.25: R5.2 10.5,45 13.5,48
  Top 2.54: L3.1 16.95,44.55 13.5,48 12,49.5 R1.1
  pour Top (no thermals): 9,53.5 24,53.5 24,41.5 14,41.5 9,46.5
INA226
  Top 0.152: R2.2 77.22,39.62 R4.2
  Top 0.2: 79.6,43.15 L1.2
  Top 2.54: L1.2 78.21,41.01 R2.2
  pour Top (no thermals): 76.5,46.88 80,46.88 80,39 78,37 75,37 75,41.62 76.5,43.12
L-FET  (via drill 0.35)
  Top 0.152: U$9.2 46.1,26.9 45.5,26.3 45.5,20.5 49.25,16.75 v53,16.75 | v71.75,18.25 71.75,20.56 U$26.D4/PWM
  Bottom 0.152: v71.75,18.25 70.25,16.75 v53,16.75
LED1  (via drill 0.35)
  Top 0.152: LED1.A 11.39,25.46 11.39,22.75 12.76,21.38 27.62,21.38 28,21 28,15 28.62,14.38 42.08,14.38 43.6,15.9 43.6,17.07 v44.99,18.46
  Bottom 0.152: v44.99,18.46 45.61,19.08 46.78,19.08 50.62,22.91 79.68,22.91 U$26.D0/RX1/TOUCH
LED2  (via drill 0.35)
  Top 0.152: LED2.A 11.09,23.97 11.09,22.62 12.64,21.07 27.5,21.07 27.7,20.87 27.7,14.87 28.5,14.07 42.21,14.07 44.51,16.37 44.51,17.15 v45.85,18.5
  Bottom 0.152: v45.85,18.5 46.24,18.5 46.31,18.56 46.7,18.56 50.75,22.61 77.44,22.61 U$26.D1/TX1/TOUCH
LED3  (via drill 0.35)
  Top 0.152: LED3.A 8.46,24.82 12.51,20.77 27.23,20.77 27.39,20.61 27.39,14.75 28.07,14.07 28.37,13.77 | v45.78,17.6 45.22,17.04 45.22,16.65 42.33,13.77 30,13.77 28.37,13.77 | 28.37,13.77
  Bottom 0.152: v45.78,17.6 46.43,18.25 46.82,18.25 50.87,22.3 75.2,22.3 U$26.D2/CS0
LED4  (via drill 0.35)
  Top 0.152: 8.43,23.43 LED4.A 9.79,23.05 12.38,20.46 27,20.46 27.09,20.38 27.09,14.62 28.25,13.46 42.46,13.46 v46.67,17.67
  Bottom 0.152: v46.67,17.67 51,22 62.81,22 U$26.D7/RX3/DOUT
LO
  Top 0.813: 42,22.25 R28.2 36.91,22.23 QL1.4 | 42,22.25 42.65,22.25 R27.1 | QL2.4 42.41,22.66 42,22.25
N$1
  Top 0.2: U1.10 88,31.25 87.65,31.6 84.45,31.6
  Top 0.25: R3.1 84.25,31.4 C1.1 84.45,31.6
N$2
  Top 0.25: R5.1 10.5,41.5 10.35,41.35 C2.1 10.35,39.5 10.8,39.05 U2.3
N$3
  Top 0.2: U1.9 87.5,30.75 87.25,31 85.29,31 84.77,30.48 83.18,30.48 C1.2
  Top 0.25: R4.1 82.25,31.4 C1.2 82.4,31
N$4
  Top 0.25: R6.1 8.5,41.5 8.65,41.35 C2.2 8.65,39.45 8.2,39 U2.4
N$5
  Top 0.813: R15.1 50.21,38.26 U$12.A
N$6
  Top 2.54: L1.1 65,44.55 | 65,44.55 57.09,44.55 L2.P$2 | 65,44.55 65.5,44.05 | 65,44.55 65,36.75 C1-1.+
  pour Top (isolate 0.61, no thermals): 51,38 66,38 70,42 70,46.75 69.75,47 53.75,47 50.75,44 50.75,38.25
N$7
  Top 0.152: R17.1 LED1.C
N$8
  Top 0.152: R18.1 LED2.C
N$9
  Top 0.152: 2.92,35.67 U3.6
  Top 0.25: U3.6 U3.7 3.58,35.52 R9.2
N$10
  Top 0.152: LED3.C 5.11,24.82 R19.1
N$13
  Top 0.152: R20.1 LED4.C
N$14
  Bottom 0.254: R25.2 10.9,9.1 I2C.2
N$15
  Bottom 0.254: R26.2 5.4,9.1 I2C.1
N$16
  Bottom 0.152: U$18.NEG R34.1 U$19.3
N$17
  Top 0.813: R27.2 44,25 43.75,25.25 43.75,29.62 44.5,30.38 50.62,30.38 51.18,29.82 U$9.6
N$18
  Top 0.508: S3V.2 67.27,69.5 78E3.3.IN
N$19
  Top 1.27: 7812.IN 20.96,70.04 22.27,68.73 S12V.2
N$28
  Bottom 0.254: R29.2 10.9,16.9 SERIAL2.2
N$29
  Bottom 0.254: R30.2 5.4,16.9 SERIAL2.1
OUT1  (via drill 0.35)
  Top 0.152: v45.75,69 48.05,71.31 52.13,71.31 53.55,69.88 53.55,66.88 72.31,48.13 72.31,29.87 69.72,27.28 69.59,27.16 69,26.57 69,22.75 66.87,20.62 U$26.D6/CS1/PWM
  Bottom 0.152: R31.2 46.3,72.15 U$5.1 46.3,69.55 v45.75,69
OUT2  (via drill 0.35)
  Top 0.152: v37.75,69 39.5,67.25 46,67.25 49.75,71 52,71 53.25,69.75 53.25,66.75 72,48 72,30 67,25 57,25 56.57,24.57 U$26.D10/TX2/CS0/PWM
  Bottom 0.152: R32.2 38.3,72.15 U$6.1 38.3,69.55 v37.75,69
OUT3  (via drill 0.35)
  Top 0.152: v29.75,73.25 33.75,73.25 35.39,71.61 52.25,71.61 53.86,70 53.86,67 72.61,48.25 72.61,30 | 72.61,30 | 72.61,30 72.61,29.75 71.93,29.07 71.68,28.82 69.31,26.44 69.31,22.62 69.27,22.59 U$26.D5/TX1/PWM
  Bottom 0.152: U$7.1 30.3,72.15 R33.2 30.4,72.6 v29.75,73.25
PURGE
  Bottom 0.254: D2.1 43.95,69.95 PURGEVALVE.2
  Bottom 0.508: U$6.3 42.4,68.4 PURGEVALVE.2
RX2
  Bottom 0.152: R29.1 16.5,14.5 17.5,15.5 19.25,15.5 21.25,17.5 23,17.5 23,16 23.25,15.75 27.93,15.75 28.35,16.17 30.26,16.17 31.13,15.3 46.05,15.3 46.63,15.89 47.19,15.89 50.59,19.29 57.39,19.29 57.76,18.92 58.27,18.92 U$26.D26/RX2
SCL  (via drill 0.35)
  Top 0.152: 86,34.97 U1.5 86,35.11 87,36.11 89,36.11 89.64,35.47 89.64,9 89.64,8.64 89.64,8.21 84.58,3.15 84.58,2.76 84,2.18 v84,2
  Bottom 0.152: U$26.D16/A2/SCL/TOUCH 59.25,5.24 R11.1 60.17,2.18 62.09,2.18 62.27,2 v84,2
SCL2
  Bottom 0.152: U$26.D29 54.03,7.91 52.88,6.75 52.01,6.75 51.98,6.73 50.27,6.73 49,8 49,12 47.91,13.09 31.52,13.09 26.38,7.95 21.37,7.95 20.7,8.62 20.7,10.05 20,10.75 17,10.75 16.25,11.5 R25.1
SDA  (via drill 0.35)
  Top 0.152: U1.4 86.5,35.18 87.12,35.8 88.88,35.8 89.34,35.34 89.34,8.34 v84,3
  Bottom 0.152: U$26.D17/A3/SDA/TOUCH 61.5,5.23 R12.1 62.12,2.48 62.22,2.48 62.4,2.31 83.31,2.31 v84,3
SDA2  (via drill 0.35)
  Top 0.152: v57.75,4 57.75,4.87 57.76,4.89 57.76,6.73 U$26.D30
  Bottom 0.152: R26.1 7.1,9.9 10,7 12,7 15.45,10.45 19.8,10.45 20.12,10.12 20.12,8.76 21.25,7.64 26.5,7.64 26.86,8 40.25,8 41,7.25 41,6.12 41.38,5.75 48.82,5.75 50.87,3.69 57.45,3.69 v57.75,4
SUPPLY
  Bottom 0.254: D3.1 35.95,69.95 SUPPLYVALVE.2
  Bottom 0.508: U$7.3 34.4,68.4 SUPPLYVALVE.2
TEMP+
  Top 0.152: THERMISTOR.1 54.16,69.66 54.16,67.13 72.91,48.38 72.91,30.13 | 72.91,30.13 | 72.91,30.13 72.91,29.62 69.61,26.32 69.61,22.89 70.5,22 70.5,21.5 70.5,21 70.5,15.5 71,15 78,15 79,14 79,13.38 79.03,13.36 79.03,7.52 U$26.D23/A9/TOUCH/CS2/PWM 76.77,5.26 R16.1
TX2
  Bottom 0.152: U$26.D31/TX2 59.08,7.92 57.75,9.25 50.75,9.25 49.75,10.25 49.75,12.25 48.61,13.39 31.39,13.39 26.25,8.25 21.5,8.25 21,8.75 21,11 19,13 8.6,13 R30.1
V-CAP
  Top 0.25: 3,42.65 R10.2 | 3,42.65 C6.1 R8.1 | U3.3 2.92,42.58 3,42.65
V-CAP_F  (via drill 0.35)
  Top 0.152: U3.1 6.7,40.7 7.5,41.5 7.5,43.25 7.75,43.5 11.25,43.5 11.5,43.25 11.5,39.5 12,39 12,23 13,22 28,22 29,21 29,16 v30,15 | v47,15 47.39,15 47.55,15.16 48.04,15.16 48.38,14.82 48.38,8.12 49.88,6.62 52.78,6.62 U$26.D14/A0/SCK
  Top 0.25: U3.2 U3.1
  Bottom 0.152: v30,15 30.36,14.63 46.63,14.63 v47,15
VB
  Top 0.813: U$9.13 46.1,36.77 C4.1 46.33,36.83 47,37.5 47,38.47 U$12.C
VRECT
  Top 0.152: QH.8 32.92,39.95 32.98,40 | MBR.3 35,40.98 QH.TH
  Top 0.254: QH.5 QH.6 QH.7 QH.8 | QH.TH 33.12,42.59 32.98,40
  Top 2.54: 29.73,44.27 L3.2 32.75,41 QH.TH 35.02,40.52 | MBR.3 29.25,36 C2-1.+
  pour Top (no thermals): 25,48 37,48 37,34 32.75,34 31.5,32.75 31.5,30.5 31,30 24,30 23,31 23,38 25,40
VS
  Top 0.508: QH.2 QH.3 | QH.2 QH.1 38.58,37.16 MBR.2 MBR.1 38.59,34.86 QL2.8 | L2.P$1 42.74,40.37 QH.2 | QL1.TH 35.04,29.68 QL2.TH 38.59,31.59 QL2.8 | QL2.8 QL2.7 QL2.6 QL2.5 | QL2.8 38.55,31.82 QL1.5 36.91,31.63 QL1.TH | QL1.TH 33.09,31.63 QL1.8 | QL1.TH 34.37,30.36 QL1.7
  Top 0.61: 41.36,40.37 L2.P$1
  Top 0.813: C4.2 44.34,40.12 L2.P$1 | U$9.11 48.64,32.27 48,31.62 41.3,31.62 QL2.6
  Top 1.27: QL1.TH 33.23,29.73 31.5,28 31.5,22 TVS2.C
  pour Top (no thermals): 40.75,43.75 46,43.75 46,38.5 45,37.5 45,36.25 43,34.25 43,27.25 32.5,27.25 32.5,32.5 33,33 37.5,33 38,33.5 38,42 40,42 40.75,42.75

### Text on the board
tPlace: SC OUT + | FC IN + | 30V UNFUSED | TLV272 | INA168 | IR21834 | INA226 | 1 | 2 | 3 | 4 | TX | RX | TEENSY 3.2 | SDA | SCL | I2C
bPlace: SC OUT GND | FC IN GND | Duke Electric Vehicles - SEM / Fuel Cell Controller v3.0 / Designed 05/21/2018 by Gerry Chen